# EAGLE design PointMotorBoard (EAGLE 9.6.2)
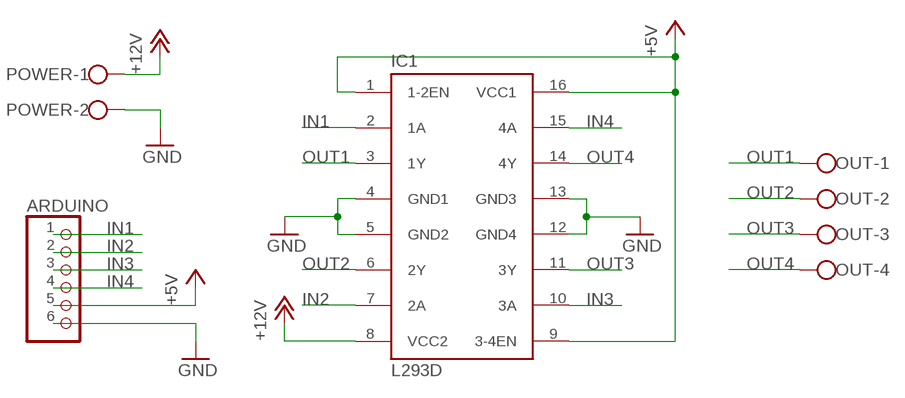
[diagram p0: schematic, sheet 1]

## Parts
ARDUINO  PINHD-1X6  [1X06]
IC1  L293D  [DIL16]
OUT  W237-4  [W237-4]
POWER  W237-102  [W237-102]

## Nets
+5V: ARDUINO.5 IC1.1(1-2EN) IC1.9(3-4EN) IC1.16(VCC1)
+12V [power]: IC1.8(VCC2) POWER.1
GND [power]: ARDUINO.6 IC1.4(GND1) IC1.5(GND2) IC1.12(GND4) IC1.13(GND3) POWER.2
IN1: ARDUINO.1 IC1.2(1A)
IN2: ARDUINO.2 IC1.7(2A)
IN3: ARDUINO.3 IC1.10(3A)
IN4: ARDUINO.4 IC1.15(4A)
OUT1 [power]: IC1.3(1Y) OUT.1
OUT2 [power]: IC1.6(2Y) OUT.2
OUT3 [power]: IC1.11(3Y) OUT.3
OUT4 [power]: IC1.14(4Y) OUT.4

## Library data of the parts
ARDUINO = pinhead:PINHD-1X6: PIN HEADER
IC1 = st-microelectronics:L293D: PUSH-PULL 4 CHANNEL DRIVER; MPN: L293D; OC_FARNELL: 9589619; OC_NEWARK: 56P8249
OUT = con-wago-500:W237-4: WAGO SCREW CLAMP; OC_FARNELL: unknown; OC_NEWARK: unknown
POWER = con-wago-500:W237-102: WAGO SCREW CLAMP; MPN: 237-102; OC_FARNELL: unknown; OC_NEWARK: 70K9898

## Net classes
1 power: width 0.635 mm

## Board
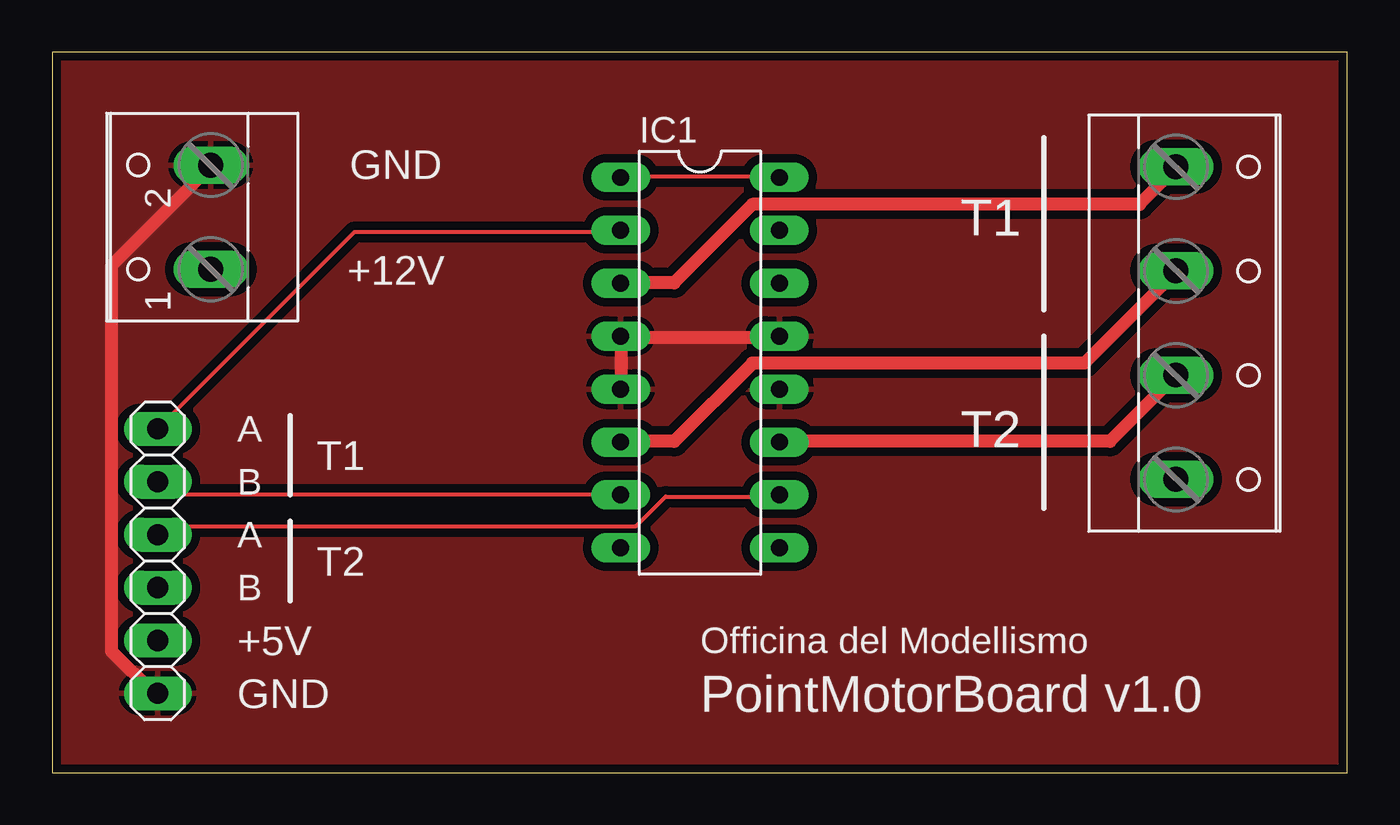
[diagram p1: board, top side]
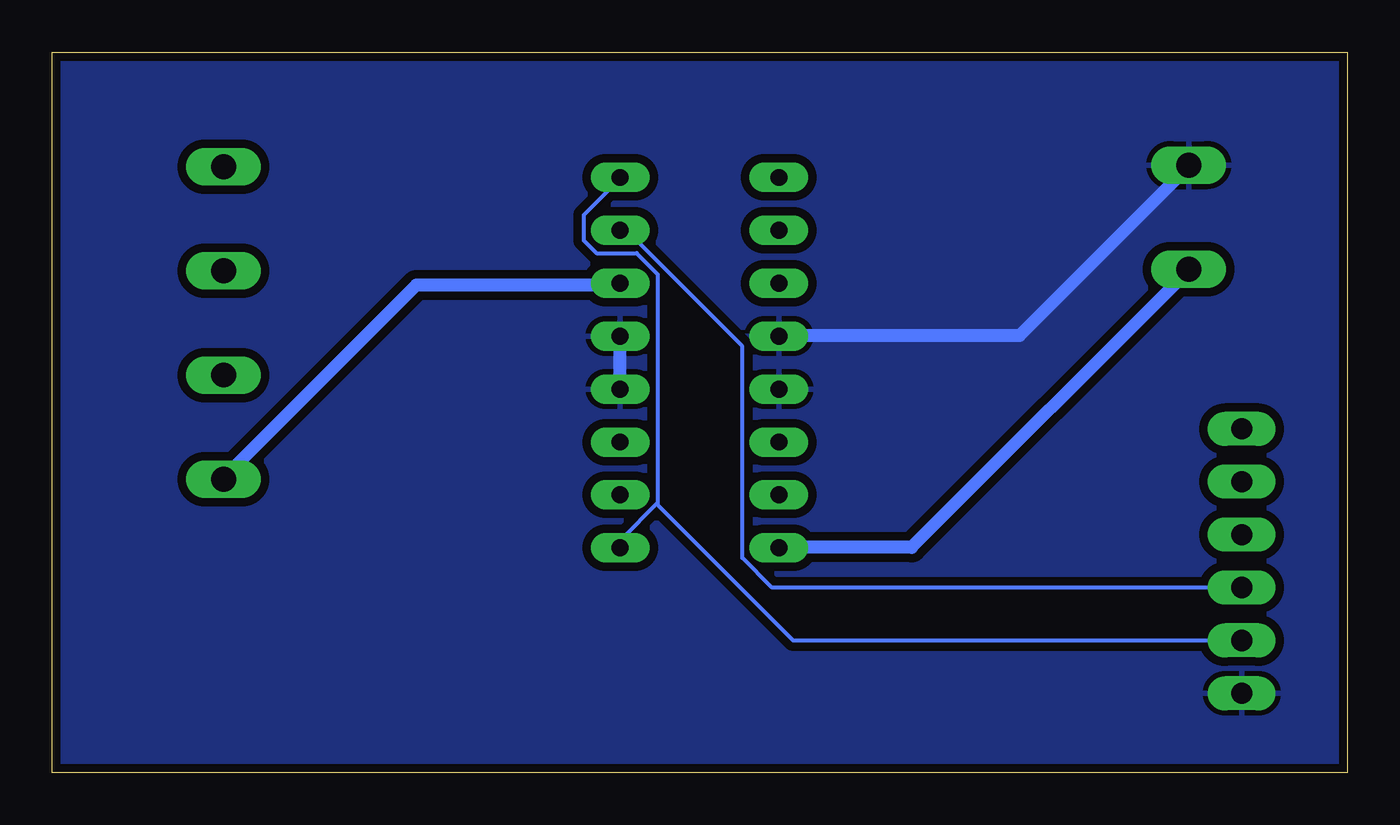
[diagram p2: board, bottom side, seen from below]

Size 62.21 x 34.59 mm. Coordinates in mm from the lower left corner, seen from the top.
Outline: 0,0 62.21,0 62.21,34.59 0,34.59 0,0
Copper layers (1*16): Top 0.035mm / dielectric 1.5mm / Bottom 0.035mm
Design rules "SparkFun": minimum track width 8mil, minimum drill 20mil, track to track 8mil, track to pad 8mil, pad to pad 8mil, via to via 8mil, smd to smd 8mil, copper to edge 10mil, drill to drill 8mil, minimum pad ring 12mil, minimum via ring 10mil, stop-mask expansion 4mil, vias tented up to drill 25mil, thermal gap 10mil

### Footprints (pad centres in the part's own frame; a part is rotated, then mirrored left to right if it is on the bottom)
1X06 = drill 1.016 long: 1 -6.35,0; 2 -3.81,0; 3 -1.27,0; 4 1.27,0; 5 3.81,0; 6 6.35,0
DIL16 = drill 0.813 long: 1 -8.89,-3.81; 2 -6.35,-3.81; 3 -3.81,-3.81; 4 -1.27,-3.81; 5 1.27,-3.81; 6 3.81,-3.81; 7 6.35,-3.81; 8 8.89,-3.81; 9 8.89,3.81; 10 6.35,3.81; 11 3.81,3.81; 12 1.27,3.81; 13 -1.27,3.81; 14 -3.81,3.81; 15 -6.35,3.81; 16 -8.89,3.81
W237-4 = drill 1.194 long: 1 -7.5,-1.27; 2 -2.5,-1.27; 3 2.5,-1.27; 4 7.5,-1.27
W237-102 = drill 1.194 long: 1 -2.5,-1.27; 2 2.5,-1.27

### Placement (x,y rotation side)
ARDUINO  5.08,10.16 270 top
IC1  31.11,19.68 270 top
OUT  55.24,21.59 270 top
POWER  6.35,26.67 90 top

### Tracks (layer width: path | path; a pad name or v marks a point on that pad's centre or on a via)
+5V
  Top 0.203: IC1.1 27.33,28.6 34.85,28.6 IC1.16
  Bottom 0.203: 33.17,12.9 33.12,12.95 33.12,23.93 34.14,24.94 36.07,24.94 36.68,25.55 36.68,26.77 34.95,28.5 IC1.16 | 33.17,12.9 34.85,11.23 34.85,10.82 IC1.9 | ARDUINO.5 26.62,6.35 33.17,12.9
+12V
  Bottom 0.635: IC1.8 27.23,10.82 20.93,10.82 7.62,24.13 POWER.1
GND
  Top 0.635: IC1.5 27.33,18.44 27.33,20.88 IC1.4 27.64,20.88 34.85,20.88 IC1.13 | ARDUINO.6 4.88,3.81 2.85,5.84 2.85,24.33 7.62,29.11 POWER.2
  Bottom 0.635: IC1.12 34.95,18.44 34.95,20.88 IC1.13 | IC1.4 27.23,20.98 15.75,20.98 7.62,29.11 POWER.2
  pour Top (isolate 0.406): 0,34.92 0,0 62.23,0 62.23,34.29 62.23,34.92
  pour Bottom (isolate 0.406): 0,34.92 0,0 62.23,0 62.23,34.92
IN1
  Top 0.203: ARDUINO.1 14.53,25.96 27.23,25.96 IC1.2
IN2
  Top 0.203: ARDUINO.2 5.69,13.36 27.23,13.36 IC1.7
IN3
  Top 0.203: ARDUINO.3 5.49,11.84 28.04,11.84 29.46,13.26 34.85,13.26 IC1.10
IN4
  Bottom 0.203: ARDUINO.4 27.64,8.89 29.06,10.31 29.06,20.47 34.54,25.96 34.85,25.96 IC1.15
OUT1
  Top 0.635: IC1.3 27.33,23.52 29.87,23.52 33.63,27.28 52.22,27.28 53.95,29.01 OUT.1
OUT2
  Top 0.635: IC1.6 27.33,15.9 29.87,15.9 33.63,19.66 49.58,19.66 53.95,24.03 OUT.2
OUT3
  Top 0.635: IC1.11 34.95,15.9 50.8,15.9 53.95,19.05 OUT.3
OUT4
  Bottom 0.635: IC1.14 34.95,23.42 44.7,23.42 53.95,14.17 OUT.4

### Text on the board
tPlace: GND | T1 | +12V | A | T2 | T1 | B | A | T2 | B | +5V | Officina del Modellismo | GND | PointMotorBoard v1.0